# Altium schematic sheet K22F.SchDoc
size A4
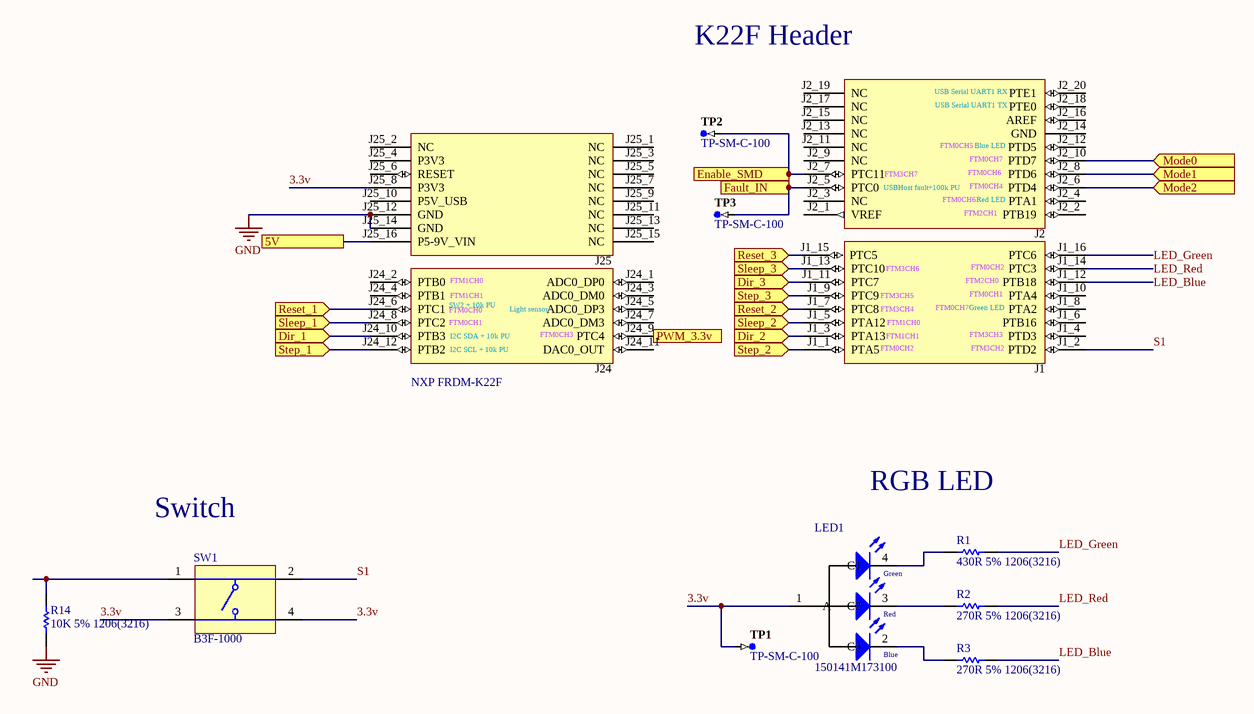
[diagram p0: K22F.SchDoc]

## Parts
*1  NXP FRDM-K22F  [FRDM-K22F]
LED1  150141M173100  [3528_A]
R1  430R 5% 1206(3216)  [RESC1206(3216)_L]
R2  270R 5% 1206(3216)  [RESC1206(3216)_N]
R3  270R 5% 1206(3216)  [RESC1206(3216)_N]
R14  10K 5% 1206(3216)  [RESC1206(3216)_M]
SW1  B3F-1000  [OMRON-B3F-1000-4_V]
TP1  TP-SM-C-100  [TP-SM-C-100]  (no BOM)
TP2  TP-SM-C-100  [TP-SM-C-100]  (no BOM)
TP3  TP-SM-C-100  [TP-SM-C-100]  (no BOM)

## Ports
5V, Dir_1 (in), Dir_2 (in), Dir_3 (in), Enable_SMD (in), Fault_IN (in), Mode0 (in), Mode1 (in), Mode2 (in), PWM_3.3v (out), Reset_1 (in), Reset_2 (in), Reset_3 (in), Sleep_1 (in), Sleep_2 (in), Sleep_3 (in), Step_1 (in), Step_2 (in), Step_3 (in)

## Nets
GND: *1.J25_12(GND) *1.J25_14(GND) R14.1
3.3v: *1.J25_8(P3V3) LED1.1(A) SW1.3 SW1.4 TP1.1
5V: *1.J25_16(P5-9V_VIN) ; port 5V
Dir_1: *1.J24_10(PTB3) ; port Dir_1
Dir_2: *1.J1_3(PTA13) ; port Dir_2
Dir_3: *1.J1_11(PTC7) ; port Dir_3
Enable_SMD: *1.J2_7(PTC11) TP2.1 ; port Enable_SMD
Fault_IN: *1.J2_5(PTC0) TP3.1 ; port Fault_IN
LED_Blue: *1.J1_12(PTB18) R3.2
LED_Green: *1.J1_16(PTC6) R1.2
LED_Red: *1.J1_14(PTC3) R2.2
Mode0: *1.J2_10(PTD7) ; port Mode0
Mode1: *1.J2_8(PTD6) ; port Mode1
Mode2: *1.J2_6(PTD4) ; port Mode2
PWM_3.3v: *1.J24_9(PTC4) ; port PWM_3.3v
Reset_1: *1.J24_6(PTC1) ; port Reset_1
Reset_2: *1.J1_7(PTC8) ; port Reset_2
Reset_3: *1.J1_15(PTC5) ; port Reset_3
S1: *1.J1_2(PTD2) SW1.2
Sleep_1: *1.J24_8(PTC2) ; port Sleep_1
Sleep_2: *1.J1_5(PTA12) ; port Sleep_2
Sleep_3: *1.J1_13(PTC10) ; port Sleep_3
Step_1: *1.J24_12(PTB2) ; port Step_1
Step_2: *1.J1_1(PTA5) ; port Step_2
Step_3: *1.J1_9(PTC9) ; port Step_3
NetLED1_2: LED1.2(C3) R3.1
NetLED1_3: LED1.3(C2) R2.1
NetLED1_4: LED1.4(C1) R1.1
NetR14_2: R14.2 SW1.1

Not connected (* = marked no-connect by the designer): *1 J1_4(PTD3) J1_6(PTB16) J1_8(PTA2) J1_10(PTA4) J2_1(VREF) J2_2(PTB19) J2_3(NC) J2_4(PTA1) J2_9(NC) J2_11(NC) J2_12(PTD5) J2_13(NC) J2_14(GND) J2_15(NC) J2_16(AREF) J2_17(NC) J2_18(PTE0) J2_19(NC) J2_20(PTE1) J24_1(ADC0_DP0) J24_2(PTB0) J24_3(ADC0_DM0) J24_4(PTB1) J24_5(ADC0_DP3) J24_7(ADC0_DM3) J24_11(DAC0_OUT) J25_1(NC) J25_2(NC) J25_3(NC) J25_4(P3V3) J25_5(NC) J25_6(RESET) J25_7(NC) J25_9(NC) J25_10(P5V_USB) J25_11(NC) J25_13(NC) J25_15(NC)

## Notes on the sheet
- (near *1) K22F Header
- RGB LED
- Switch
- CC2511 Assignment2 Group 3
- Date:
- Sheet
- of
- Time:
- Revision:
- Kim Bender, Peng Cheng
- Levi Smith, Fuzhen Liu
- Drawn by:
- File:
- (in symbol CMP-1431-00001-1) Green; Red; Blue
- (in symbol NXP FRDM-K22F) USB Serial UART1 RX; USB Serial UART1 TX; FTM0CH5; Blue LED; FTM0CH7; FTM3CH7; FTM0CH6; USBHost fault+100k PU; FTM0CH4; Red LED; FTM2CH1; J2; J25; FTM3CH6; FTM0CH2; FTM1CH0; FTM2CH0; FTM1CH1; FTM3CH5; FTM0CH1; SW2 + 10k PU; FTM0CH0; Light sensor; FTM3CH4; Green LED; I2C SDA + 10k PU; FTM0CH3; FTM3CH3; I2C SCL + 10k PU; FTM3CH2; J24; J1

## Library data of the parts
LED1 = CMP-1431-00001-1: SMD Full-Color Top LED, WL-SFTW, Red & Green & Blue; Manufacturer: Wuerth Elektronik; PackageReference: 3528_A; PartNumber: 150141M173100; ComponentLink2Description: Datasheet; ComponentLink1URL: http://www.we-online.com; Color: Red & Green & Blue; ComponentLink1Description: Manufacturer URL; ComponentLink2URL: http://katalog.we-online.com/led/datasheet/150141M173100.pdf
R1 = CMP-1014-00065-1: 430R 0.25W 5% 1206 (3216 Metric)  SMD; Case-Metric: 3216; Case-EIA: 1206; Value: 430.00 Ohm; Power: 0.25 W; Technology: SMT; Tolerance: 5 %
R2 R3 = CMP-1014-00060-1: 270R 0.25W 5% 1206 (3216 Metric)  SMD; Value: 270.00 Ohm; Case-Metric: 3216; Case-EIA: 1206; Tolerance: 5 %; Technology: SMT; Power: 0.25 W
R14 = CMP-1014-00098-1: 10K 0.25W 5% 1206 (3216 Metric)  SMD; Value: 10000.00 Ohm; Case-Metric: 3216; Case-EIA: 1206; Power: 0.25 W; Tolerance: 5 %; Technology: SMT
SW1 = CMP-1677-00002-1: Tactile Switch, SPST-NO, 0.05 A, 5 to 24 V, -25 to 70 degC, 4-Pin THD, RoHS, Bulk; Shielding: Shielded; Gender: Female; Capacitance: -45 f; Voltage Rating: 150 V; Current Rating: 1.5 A; Radiation Hardening: No; Contact Plating: Gold; Height: 14.99 mm; Min Operating Temperature: -40 degC; Packaging: Tray; ComponentLink2Description: Datasheet; ComponentLink1URL: http://www.omron.com/; Lead Pitch: 1.27 mm; RoHSCompliant: true; Pins: 8; PackageReference: B3F-1000; Width: 25.4 mm; Contact Material: Brass; ComponentLink2URL: http://www.omron.com/ecb/products/pdf/en-b3f.pdf; PackageDescription: 4-Pin Through Hole Device, Body 6 x 6 mm; DatasheetVersion: Jan-15; ComponentLink1Description: Manufacturer URL; Package Quantity: 1080; Mount: Through Hole; Length: 18.34 mm; Max Operating Temperature: 70 degC
TP1-TP3 = CMP-0484-00002-2: Test Point, Surface Mount, Circular, Pad Diameter 1 mm; Manufacturer: No Vendor; PartNumber: TP-SM-C-100